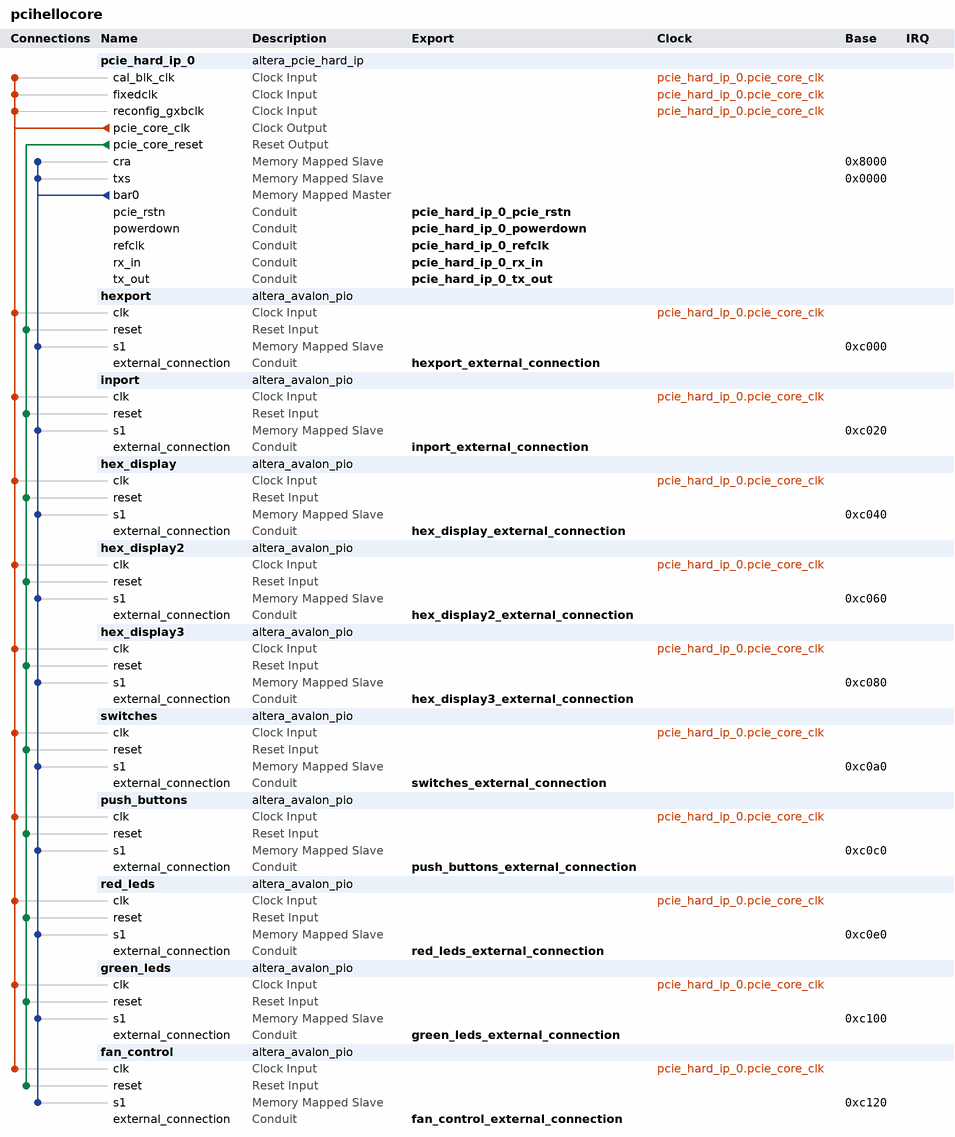
[diagram p0: system contents]
# Platform Designer (Qsys) system pcihellocore, Cyclone IV GX EP4CGX150DF31C7
# Parameters at their usual value, and those the tool derives, are not listed.
package require -exact qsys 17.1
create_system pcihellocore
set_project_property DEVICE_FAMILY {Cyclone IV GX}
set_project_property DEVICE EP4CGX150DF31C7

add_instance pcie_hard_ip_0 altera_pcie_hard_ip 17.1
set_instance_parameter_value pcie_hard_ip_0 {BAR Type} {32 bit Non-Prefetchable,Not used,Not used,Not used,Not used,Not used}
set_instance_parameter_value pcie_hard_ip_0 CB_A2P_ADDR_MAP_PASS_THRU_BITS 15
set_instance_parameter_value pcie_hard_ip_0 CG_ENABLE_A2P_INTERRUPT 0
set_instance_parameter_value pcie_hard_ip_0 CG_NO_CPL_REORDERING 0
set_instance_parameter_value pcie_hard_ip_0 {PCIe Address 31:0} 0x00000000,0x00000000,0x00000000,0x00000000,0x00000000,0x00000000,0x00000000,0x00000000,0x00000000,0x00000000,0x00000000,0x00000000,0x00000000,0x00000000,0x00000000,0x00000000
set_instance_parameter_value pcie_hard_ip_0 {PCIe Address 63:32} 0x00000000,0x00000000,0x00000000,0x00000000,0x00000000,0x00000000,0x00000000,0x00000000,0x00000000,0x00000000,0x00000000,0x00000000,0x00000000,0x00000000,0x00000000,0x00000000
set_instance_parameter_value pcie_hard_ip_0 class_code 0
set_instance_parameter_value pcie_hard_ip_0 device_id 4
set_instance_parameter_value pcie_hard_ip_0 my_advanced_errors false
set_instance_parameter_value pcie_hard_ip_0 my_enable_ecrc_check false
set_instance_parameter_value pcie_hard_ip_0 my_enable_ecrc_gen false
set_instance_parameter_value pcie_hard_ip_0 p_pcie_app_clk 1
set_instance_parameter_value pcie_hard_ip_0 p_pcie_test_out_width None
set_instance_parameter_value pcie_hard_ip_0 p_user_msi_enable 0
set_instance_parameter_value pcie_hard_ip_0 subsystem_device_id 4
set_instance_parameter_value pcie_hard_ip_0 subsystem_vendor_id 4466
set_instance_parameter_value pcie_hard_ip_0 vendor_id 4466

add_instance hexport altera_avalon_pio 17.1
set_instance_parameter_value hexport direction Output
set_instance_parameter_value hexport width 32

add_instance inport altera_avalon_pio 17.1
set_instance_parameter_value inport direction Input
set_instance_parameter_value inport width 16

add_instance hex_display altera_avalon_pio 17.1
set_instance_parameter_value hex_display direction Output
set_instance_parameter_value hex_display resetValue 1077952576
set_instance_parameter_value hex_display width 32

add_instance hex_display2 altera_avalon_pio 17.1
set_instance_parameter_value hex_display2 direction Output
set_instance_parameter_value hex_display2 width 32

add_instance hex_display3 altera_avalon_pio 17.1
set_instance_parameter_value hex_display3 direction Output
set_instance_parameter_value hex_display3 width 32

add_instance switches altera_avalon_pio 17.1
set_instance_parameter_value switches direction Input
set_instance_parameter_value switches width 32

add_instance push_buttons altera_avalon_pio 17.1
set_instance_parameter_value push_buttons direction Input
set_instance_parameter_value push_buttons width 32

add_instance red_leds altera_avalon_pio 17.1
set_instance_parameter_value red_leds direction Output
set_instance_parameter_value red_leds width 32

add_instance green_leds altera_avalon_pio 17.1
set_instance_parameter_value green_leds direction Output
set_instance_parameter_value green_leds width 32

add_instance fan_control altera_avalon_pio 17.1
set_instance_parameter_value fan_control direction Output
set_instance_parameter_value fan_control width 32

# connections
add_connection pcie_hard_ip_0.pcie_core_clk fan_control.clk clock
add_connection pcie_hard_ip_0.pcie_core_clk green_leds.clk clock
add_connection pcie_hard_ip_0.pcie_core_clk hex_display2.clk clock
add_connection pcie_hard_ip_0.pcie_core_clk hex_display3.clk clock
add_connection pcie_hard_ip_0.pcie_core_clk hex_display.clk clock
add_connection pcie_hard_ip_0.pcie_core_clk hexport.clk clock
add_connection pcie_hard_ip_0.pcie_core_clk inport.clk clock
add_connection pcie_hard_ip_0.pcie_core_clk pcie_hard_ip_0.cal_blk_clk clock
add_connection pcie_hard_ip_0.pcie_core_clk pcie_hard_ip_0.fixedclk clock
add_connection pcie_hard_ip_0.pcie_core_clk pcie_hard_ip_0.reconfig_gxbclk clock
add_connection pcie_hard_ip_0.pcie_core_clk push_buttons.clk clock
add_connection pcie_hard_ip_0.pcie_core_clk red_leds.clk clock
add_connection pcie_hard_ip_0.pcie_core_clk switches.clk clock
add_connection pcie_hard_ip_0.pcie_core_reset fan_control.reset reset
add_connection pcie_hard_ip_0.pcie_core_reset green_leds.reset reset
add_connection pcie_hard_ip_0.pcie_core_reset hex_display2.reset reset
add_connection pcie_hard_ip_0.pcie_core_reset hex_display3.reset reset
add_connection pcie_hard_ip_0.pcie_core_reset hex_display.reset reset
add_connection pcie_hard_ip_0.pcie_core_reset hexport.reset reset
add_connection pcie_hard_ip_0.pcie_core_reset inport.reset reset
add_connection pcie_hard_ip_0.pcie_core_reset push_buttons.reset reset
add_connection pcie_hard_ip_0.pcie_core_reset red_leds.reset reset
add_connection pcie_hard_ip_0.pcie_core_reset switches.reset reset
add_connection pcie_hard_ip_0.bar0 fan_control.s1 avalon
set_connection_parameter_value pcie_hard_ip_0.bar0/fan_control.s1 baseAddress 0xc120
add_connection pcie_hard_ip_0.bar0 green_leds.s1 avalon
set_connection_parameter_value pcie_hard_ip_0.bar0/green_leds.s1 baseAddress 0xc100
add_connection pcie_hard_ip_0.bar0 hex_display2.s1 avalon
set_connection_parameter_value pcie_hard_ip_0.bar0/hex_display2.s1 baseAddress 0xc060
add_connection pcie_hard_ip_0.bar0 hex_display3.s1 avalon
set_connection_parameter_value pcie_hard_ip_0.bar0/hex_display3.s1 baseAddress 0xc080
add_connection pcie_hard_ip_0.bar0 hex_display.s1 avalon
set_connection_parameter_value pcie_hard_ip_0.bar0/hex_display.s1 baseAddress 0xc040
add_connection pcie_hard_ip_0.bar0 hexport.s1 avalon
set_connection_parameter_value pcie_hard_ip_0.bar0/hexport.s1 baseAddress 0xc000
add_connection pcie_hard_ip_0.bar0 inport.s1 avalon
set_connection_parameter_value pcie_hard_ip_0.bar0/inport.s1 baseAddress 0xc020
add_connection pcie_hard_ip_0.bar0 pcie_hard_ip_0.cra avalon
set_connection_parameter_value pcie_hard_ip_0.bar0/pcie_hard_ip_0.cra baseAddress 0x8000
add_connection pcie_hard_ip_0.bar0 pcie_hard_ip_0.txs avalon
set_connection_parameter_value pcie_hard_ip_0.bar0/pcie_hard_ip_0.txs baseAddress 0x0000
add_connection pcie_hard_ip_0.bar0 push_buttons.s1 avalon
set_connection_parameter_value pcie_hard_ip_0.bar0/push_buttons.s1 baseAddress 0xc0c0
add_connection pcie_hard_ip_0.bar0 red_leds.s1 avalon
set_connection_parameter_value pcie_hard_ip_0.bar0/red_leds.s1 baseAddress 0xc0e0
add_connection pcie_hard_ip_0.bar0 switches.s1 avalon
set_connection_parameter_value pcie_hard_ip_0.bar0/switches.s1 baseAddress 0xc0a0

# exported interfaces
add_interface fan_control_external_connection conduit end
set_interface_property fan_control_external_connection EXPORT_OF fan_control.external_connection
add_interface green_leds_external_connection conduit end
set_interface_property green_leds_external_connection EXPORT_OF green_leds.external_connection
add_interface hex_display2_external_connection conduit end
set_interface_property hex_display2_external_connection EXPORT_OF hex_display2.external_connection
add_interface hex_display3_external_connection conduit end
set_interface_property hex_display3_external_connection EXPORT_OF hex_display3.external_connection
add_interface hex_display_external_connection conduit end
set_interface_property hex_display_external_connection EXPORT_OF hex_display.external_connection
add_interface hexport_external_connection conduit end
set_interface_property hexport_external_connection EXPORT_OF hexport.external_connection
add_interface inport_external_connection conduit end
set_interface_property inport_external_connection EXPORT_OF inport.external_connection
add_interface pcie_hard_ip_0_pcie_rstn conduit end
set_interface_property pcie_hard_ip_0_pcie_rstn EXPORT_OF pcie_hard_ip_0.pcie_rstn
add_interface pcie_hard_ip_0_powerdown conduit end
set_interface_property pcie_hard_ip_0_powerdown EXPORT_OF pcie_hard_ip_0.powerdown
add_interface pcie_hard_ip_0_refclk conduit end
set_interface_property pcie_hard_ip_0_refclk EXPORT_OF pcie_hard_ip_0.refclk
add_interface pcie_hard_ip_0_rx_in conduit end
set_interface_property pcie_hard_ip_0_rx_in EXPORT_OF pcie_hard_ip_0.rx_in
add_interface pcie_hard_ip_0_tx_out conduit end
set_interface_property pcie_hard_ip_0_tx_out EXPORT_OF pcie_hard_ip_0.tx_out
add_interface push_buttons_external_connection conduit end
set_interface_property push_buttons_external_connection EXPORT_OF push_buttons.external_connection
add_interface red_leds_external_connection conduit end
set_interface_property red_leds_external_connection EXPORT_OF red_leds.external_connection
add_interface switches_external_connection conduit end
set_interface_property switches_external_connection EXPORT_OF switches.external_connection

set_interconnect_requirement {$system} qsys_mm.clockCrossingAdapter HANDSHAKE
set_interconnect_requirement {$system} qsys_mm.maxAdditionalLatency 1

save_system pcihellocore.qsys
